# EAGLE schematic dc_dc_buck_conv (EAGLE 9.0.1)
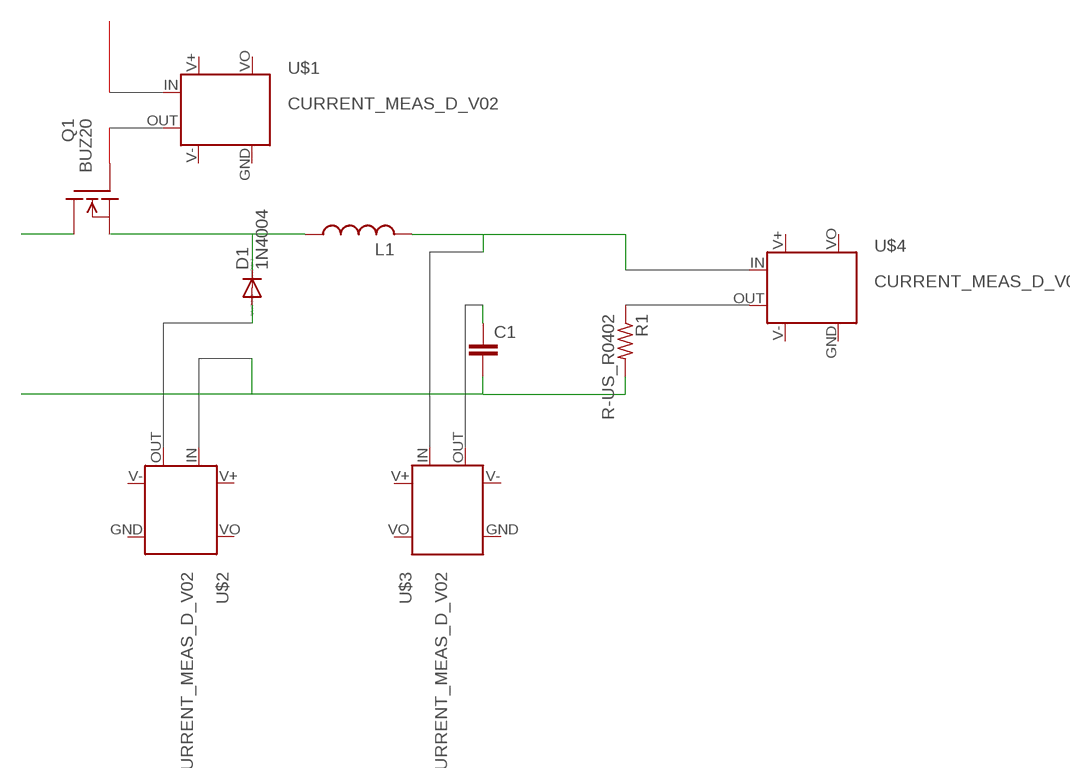
[diagram p0: schematic, sheet 1]

## Parts
C1  C2,5-3  [C2.5-3]
D1  1N4004  [DO41-10]
L1  L-US0204/5  [0204/5]
Q1  BUZ20  [TO220]
R1  R-US_R0402  [R0402]
U$1  CURRENT_MEAS_D_V02  [CURRENT_MEAS_P_V02]
U$2  CURRENT_MEAS_D_V02  [CURRENT_MEAS_P_V02]
U$3  CURRENT_MEAS_D_V02  [CURRENT_MEAS_P_V02]
U$4  CURRENT_MEAS_D_V02  [CURRENT_MEAS_P_V02]

## Nets
N$1: C1.2 R1.2
N$2: D1.C L1.1
N$3: L1.2
N$5: C1.1
N$6: D1.A
Unconnected: Q1.1(G) Q1.2(D) Q1.3(S) R1.1 U$1.GND U$1.IN U$1.OUT U$1.VO U$2.GND U$2.IN U$2.OUT U$2.VO U$3.GND U$3.IN U$3.OUT U$3.VO U$4.GND U$4.IN U$4.OUT U$4.VO

## Power pins joined to a net without a drawn wire
V+: U$1.V+ U$2.V+ U$3.V+ U$4.V+
V-: U$1.V- U$2.V- U$3.V- U$4.V-

## Library data of the parts
C1 = capacitor-wima:C: CAPACITOR naming: grid - package width
D1 = diode:1N4004: DIODE general purpose rectifier, 1 A
L1 = rcl:L-US: INDUCTOR, American symbol; SPICEPREFIX: L
Q1 = transistor-fet:BUZ20: N-Channel Enhancement MOSFET 100V; 12A; 0,2Ohm
R1 = audio amplifier example:R-US_: RESISTOR, American symbol
U$1-U$4 = current_meas:CURRENT_MEAS_D_V02